# EAGLE design utilidong-ftdi-uart-lipo-charger-mk-1.0 (EAGLE 6.5.0)
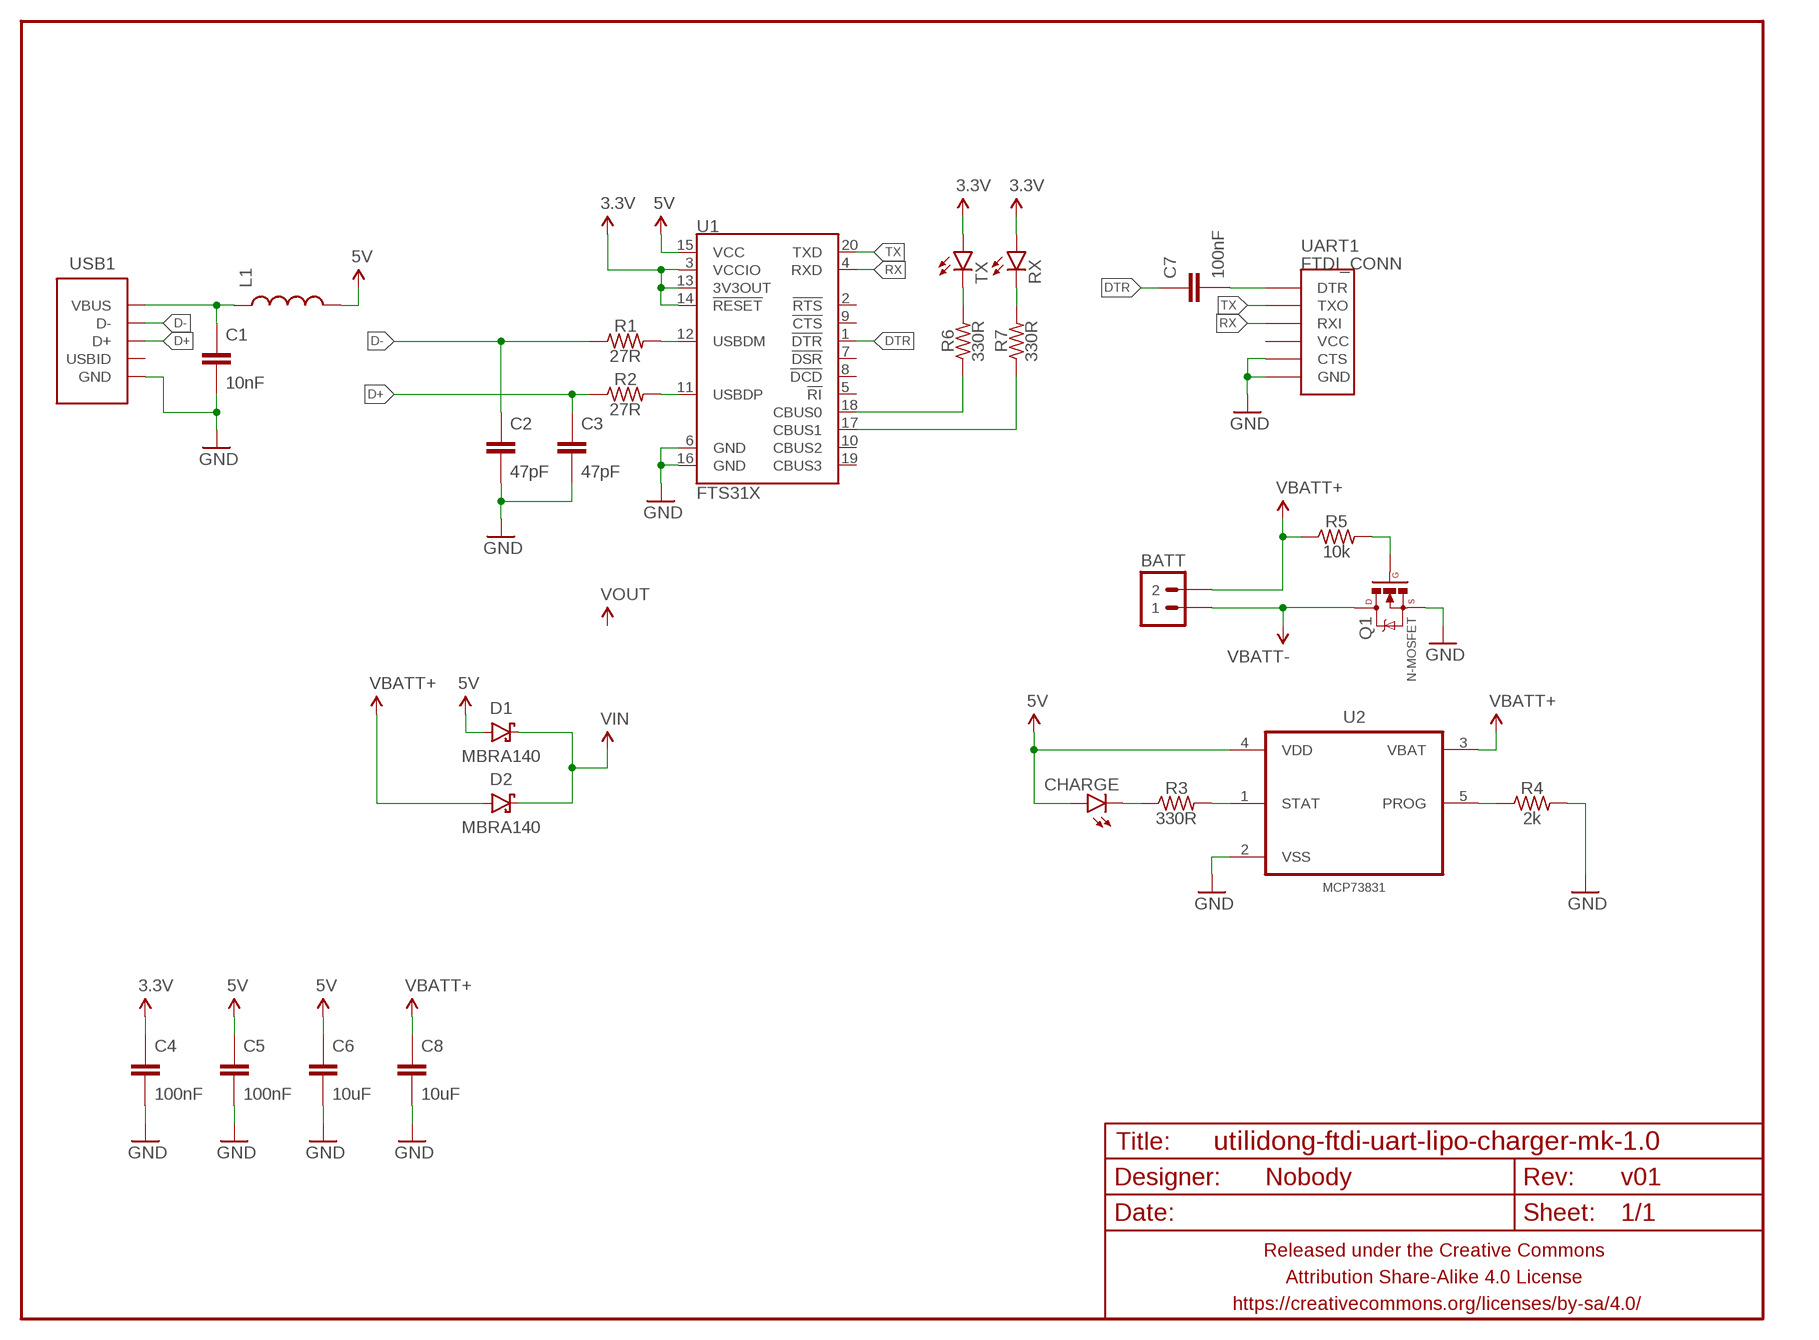
[diagram p0: schematic, sheet 1]

## Parts
BATT  M02PTH-CENTERED-R+  [1X02-CENTER-R+]
C1  10nF  CAPACITOR-CERAMICC0805  [C0805]
C2  47pF  CAPACITOR-CERAMICC0805  [C0805]
C3  47pF  CAPACITOR-CERAMICC0805  [C0805]
C4  100nF  CAPACITOR-CERAMICC0805  [C0805]
C5  100nF  CAPACITOR-CERAMICC0805  [C0805]
C6  10uF  CAPACITOR-CERAMICC0805  [C0805]
C7  100nF  CAPACITOR-CERAMICC0805  [C0805]
C8  10uF  CAPACITOR-CERAMICC0805  [C0805]
CHARGE  LED1206  [LED-1206]
D1  MBRA140  DIODE-SCHOTTKYMBRA140  [SMA-DIODE]
D2  MBRA140  DIODE-SCHOTTKYMBRA140  [SMA-DIODE]
FRAME1  FRAME-LETTERNO_PACKAGE  [DUMMY]
L1  INDUCTORL0805  [L0805]
Q1  N-MOSFET  MOSFET-NCHANNELBSS138  [SOT23]
R1  27R  RESISTORR0805  [R0805]
R2  27R  RESISTORR0805  [R0805]
R3  330R  RESISTORR0805  [R0805]
R4  2k  RESISTORR0805  [R0805]
R5  10k  RESISTORR0805  [R0805]
R6  330R  RESISTORR0805  [R0805]
R7  330R  RESISTORR0805  [R0805]
RX  LED1206  [LED-1206]
TX  LED1206  [LED-1206]
U1  FTS31X  FT231XS  [SSOP20_L]
U2  MCP73831  MCP73831T-2ACI/OT  [SOT95P280X145-5N]
UART1  FTDI_CONN  [FTDI_CONN]
USB1  USB-ABCOMBO  [USB-MICRO-B-FCI-CUTOUT]

## Nets
3.3V: C4.1 RX.A TX.A U1.3(VCCIO) U1.13(3V3OUT) U1.14(!RESET)
5V: C5.1 C6.1 CHARGE.A D1.A L1.2 U1.15(VCC) U2.4(VDD)
D+: C3.1 R2.1 USB1.3(D+)
D-: C2.1 R1.1 USB1.2(D-)
DTR: C7.1 U1.1(!DTR)
GND: C1.2 C2.2 C3.2 C4.2 C5.2 C6.2 C8.2 Q1.2(S) R4.2 U1.6(GND) U1.16(GND) U2.2(VSS) UART1.CTS UART1.GND USB1.5(GND) USB1.P$1(GND) USB1.P$2(GND)
N$1: R1.2 U1.12(USBDM)
N$2: R2.2 U1.11(USBDP)
N$3: C1.1 L1.1 USB1.1(VBUS)
N$4: C7.2 UART1.DTR
N$5: R3.2 U2.1(STAT)
N$6: CHARGE.C R3.1
N$7: R6.1 U1.18(CBUS0)
N$8: R4.1 U2.5(PROG)
N$9: R6.2 TX.C
N$10: R7.2 RX.C
N$11: Q1.1(G) R5.2
N$12: R7.1 U1.17(CBUS1)
RX: U1.4(RXD) UART1.RXI
TX: U1.20(TXD) UART1.TXO
VBATT+: BATT.2 C8.1 D2.A R5.1 U2.3(VBAT)
VBATT-: BATT.1 Q1.3(D)
VIN: D1.C D2.C
Unconnected: U1.2(!RTS) U1.5(!RI) U1.7(!DSR) U1.8(!DCD) U1.9(!CTS) U1.10(CBUS2) U1.19(CBUS3) UART1.VCC USB1.4(USBID)

## Library data of the parts
BATT = A_butts:M02: Standard 2-pin 0.1" header. Use with - straight break away headers ( PRT-00116) - right angle break away headers (PRT-00553) - swiss pins (PRT-00743) - machine pins (PRT-00117) - female headers (PRT-00115) Molex polarized connector foot print use with: PRT-08233 with associated crimp pins and housings. 2.54_SCREWTERM for use with PRT-10571. 3.5mm Screw Terminal footprints for PRT-08084 5mm Screw Terminal footprints for use with PRT-08433
C1-C8 = A_butts:CAPACITOR-CERAMIC: CAPACITOR, European symbol
CHARGE RX TX = A_butts:LED: LEDs Standard schematic elements and footprints for 5mm, 3mm, 1206, and 0603 sized LEDs. 5mm - Spark Fun Electronics SKU : COM-00529 (and others)
D1 D2 = A_butts:DIODE-SCHOTTKY: Schottky diodes in SFE's production catalog BAT20J 1A 23V 0.62Vf RB751 120mA 40V 0.37Vf PMEG4005EJ 0.5A 40V 0.42Vf MBRA140 1A 40V 0.5Vf B340A 3A 40V SMA; PROD_ID: DIO-08053
FRAME1 = A_butts:FRAME-LETTER: Schematic Frame Standard 8.5x11 US Letter frame; DESIGNER: Nobody; VERSION: v01
L1 = A_butts:INDUCTOR: Inductors Basic Inductor/Choke - 0603 and 1206. Footprints are not proven and vary greatly between part numbers. SRN6045- 33uH, 20% 1.4A SDR0403-560KL - 56uH, 10%, 500mA RMS/740mA peak
Q1 = A_butts:MOSFET-NCHANNEL: Common NMOSFET Parts MFG P/N Store ID Prod ID FDD8780 TRANS-09984 SI7820DN TRANS-11055 FDS6630A IC-08089 2N7002PW TRANS-11151 FQP30N06L COM-10213 TRANS-10060 BSS123LT1G TRANS-08345 BSS138 TRANS-00830 BS170 2N7000; PROD_ID: TRANS-00830
R1-R7 = A_butts:RESISTOR: RESISTOR, American symbol
U1 = A_butts:FT231X: FTDI FT231X Full Speed USB to Full-handshake UART This USB2.0 Full Speed IC offers a compact bridge to full handshake UART interfaces. The device is a UART, capable of operating up to 3MBaud, with low power consumption (8mA). The FT231X includes the complete FT-X series feature set and enables USB to be added into a system design quickly and easily over a UART interface.; PROD_ID: IC-11524; VALUE: FTS31XS-U
U2 = A_butts:MCP73831T-2ACI/OT: Charge Management Controller; MPN: MCP73831T-2ACI/OT; OC_FARNELL: 1332158; OC_NEWARK: 56K7045; PACKAGE: SOT-5; SUPPLIER: Microchip
UART1 = A_butts:FTDI_CONN: Connector which mates to FTDI basic or FTDI cable.
USB1 = A_butts:USB-AB: This is a USB AB connector that is compatible with USB OTG. i.e. this connector can serve as a host or device

## Board
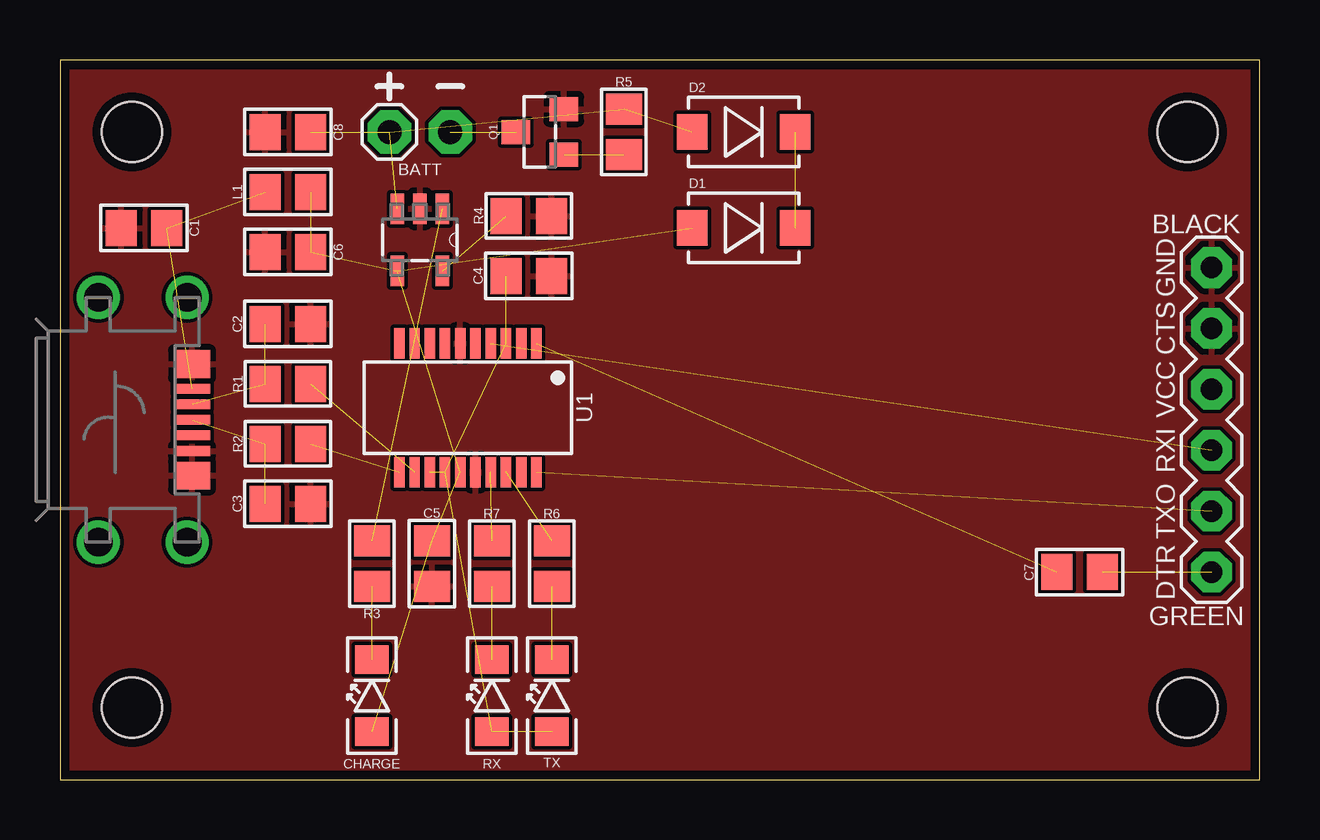
[diagram p1: board, top side]

Size 50 x 30 mm. Coordinates in mm from the lower left corner, seen from the top.
Outline: 0,0 50,0 50,30 0,30 0,0
Copper layers (1*16): Top 0.0356mm / dielectric 1.5011mm / Bottom 0.0356mm
Design rules "LaenPCBOrder_2": minimum track width 6mil, minimum drill 13mil, track to track 6mil, track to pad 6mil, pad to pad 6mil, via to via 6mil, smd to smd 6mil, copper to edge 15mil, drill to drill 6mil, minimum pad ring 7mil, minimum via ring 7mil, stop-mask expansion 3mil, vias tented up to drill 20mil, thermal gap 10mil
Holes 2.5 mm at 3,27 3,3 47,3 47,27

### Footprints (pad centres in the part's own frame; a part is rotated, then mirrored left to right if it is on the bottom)
1X02-CENTER-R+ = drill 1 pad 1.8 octagon: 1 -1.27,0; 2 1.27,0
C0805 = smd 1.3 x 1.5: 1 -0.95,0; 2 0.95,0
LED-1206 = smd 1.2 x 1.4: A -1.5,0; C 1.5,0
SMA-DIODE = smd 1.27 x 1.47: A -2.15,0; C 2.15,0
L0805 = smd 1.3 x 1.5: 1 -0.95,0; 2 0.95,0
SOT23 = smd 1 x 1.2: 1 -0.95,-1; 2 0.95,-1; 3 0,1
R0805 = smd 1.3 x 1.5: 1 -0.95,0; 2 0.95,0
SSOP20_L = smd 0.43 x 1.27: 1 -2.857,-2.68; 2 -2.223,-2.68; 3 -1.587,-2.68; 4 -0.953,-2.68; 5 -0.318,-2.68; 6 0.318,-2.68; 7 0.953,-2.68; 8 1.587,-2.68; 9 2.223,-2.68; 10 2.857,-2.68; 11 2.857,2.68; 12 2.223,2.68; 13 1.587,2.68; 14 0.953,2.68; 15 0.318,2.68; 16 -0.318,2.68; 17 -0.953,2.68; 18 -1.587,2.68; 19 -2.223,2.68; 20 -2.857,2.68
SOT95P280X145-5N = smd 1.27 x 0.559: 1 -1.295,0.94; 2 -1.295,0; 3 -1.295,-0.94; 4 1.295,-0.94; 5 1.295,0.94
FTDI_CONN = drill 0.9 pad 1.7 octagon: CTS 3.81,0; DTR -6.35,0; GND 6.35,0; RXI -1.27,0; TXO -3.81,0; VCC 1.27,0
USB-MICRO-B-FCI-CUTOUT = smd 0.4 x 1.5: 1 -1.3,0; 2 -0.65,0; 3 0,0; 4 0.65,0; 5 1.3,0 | smd 1.15 x 1.5: P$1 -2.325,0; P$2 2.325,0 | drill 1.2: P$3 -5.1,-0.2; P$4 5.1,-0.2; P$5 -5.1,-3.9; P$6 5.1,-3.9

### Placement (x,y rotation side)
BATT  15,27 180 top
C1  3.5,23 180 top
C2  9.5,19 0 top
C3  9.5,11.5 0 top
C4  19.54,21 0 top
C5  15.5,9 270 top
C6  9.5,22 180 top
C7  42.5,8.65 0 top
C8  9.5,27 180 top
CHARGE  13,3.5 90 top
D1  28.5,23 0 top
D2  28.5,27 0 top
FRAME1  0,0 0 top
L1  9.5,24.5 0 top
Q1  20,27 90 top
R1  9.5,16.5 0 top
R2  9.5,14 0 top
R3  13,9 90 top
R4  19.54,23.5 0 top
R5  23.5,27 270 top
R6  20.5,9 270 top
R7  18,9 270 top
RX  18,3.5 90 top
TX  20.5,3.5 90 top
U1  17,15.5 180 top
U2  15,22.5 270 top
UART1  48,15 90 top
USB1  5.5,15 270 top

### Tracks (layer width: path | path; a pad name or v marks a point on that pad's centre or on a via)
3.3V  (5 unrouted)
5V  (6 unrouted)
D+  (2 unrouted)
D-  (2 unrouted)
DTR  (1 unrouted)
GND
  pour Top: -0.1,-0.1 -0.1,30.1 50.1,30.1 50.1,-0.1
N$1  (1 unrouted)
N$2  (1 unrouted)
N$3  (2 unrouted)
N$4  (1 unrouted)
N$5  (1 unrouted)
N$6  (1 unrouted)
N$7  (1 unrouted)
N$8  (1 unrouted)
N$9  (1 unrouted)
N$10  (1 unrouted)
N$11  (1 unrouted)
N$12  (1 unrouted)
RX  (1 unrouted)
TX  (1 unrouted)
VBATT+  (4 unrouted)
VBATT-  (1 unrouted)
VIN  (1 unrouted)